# Altium schematic sheet STM32_Blue pill.SchDoc
size 431 x 279 mm; SheetNumber: 1; SheetTotal: 1
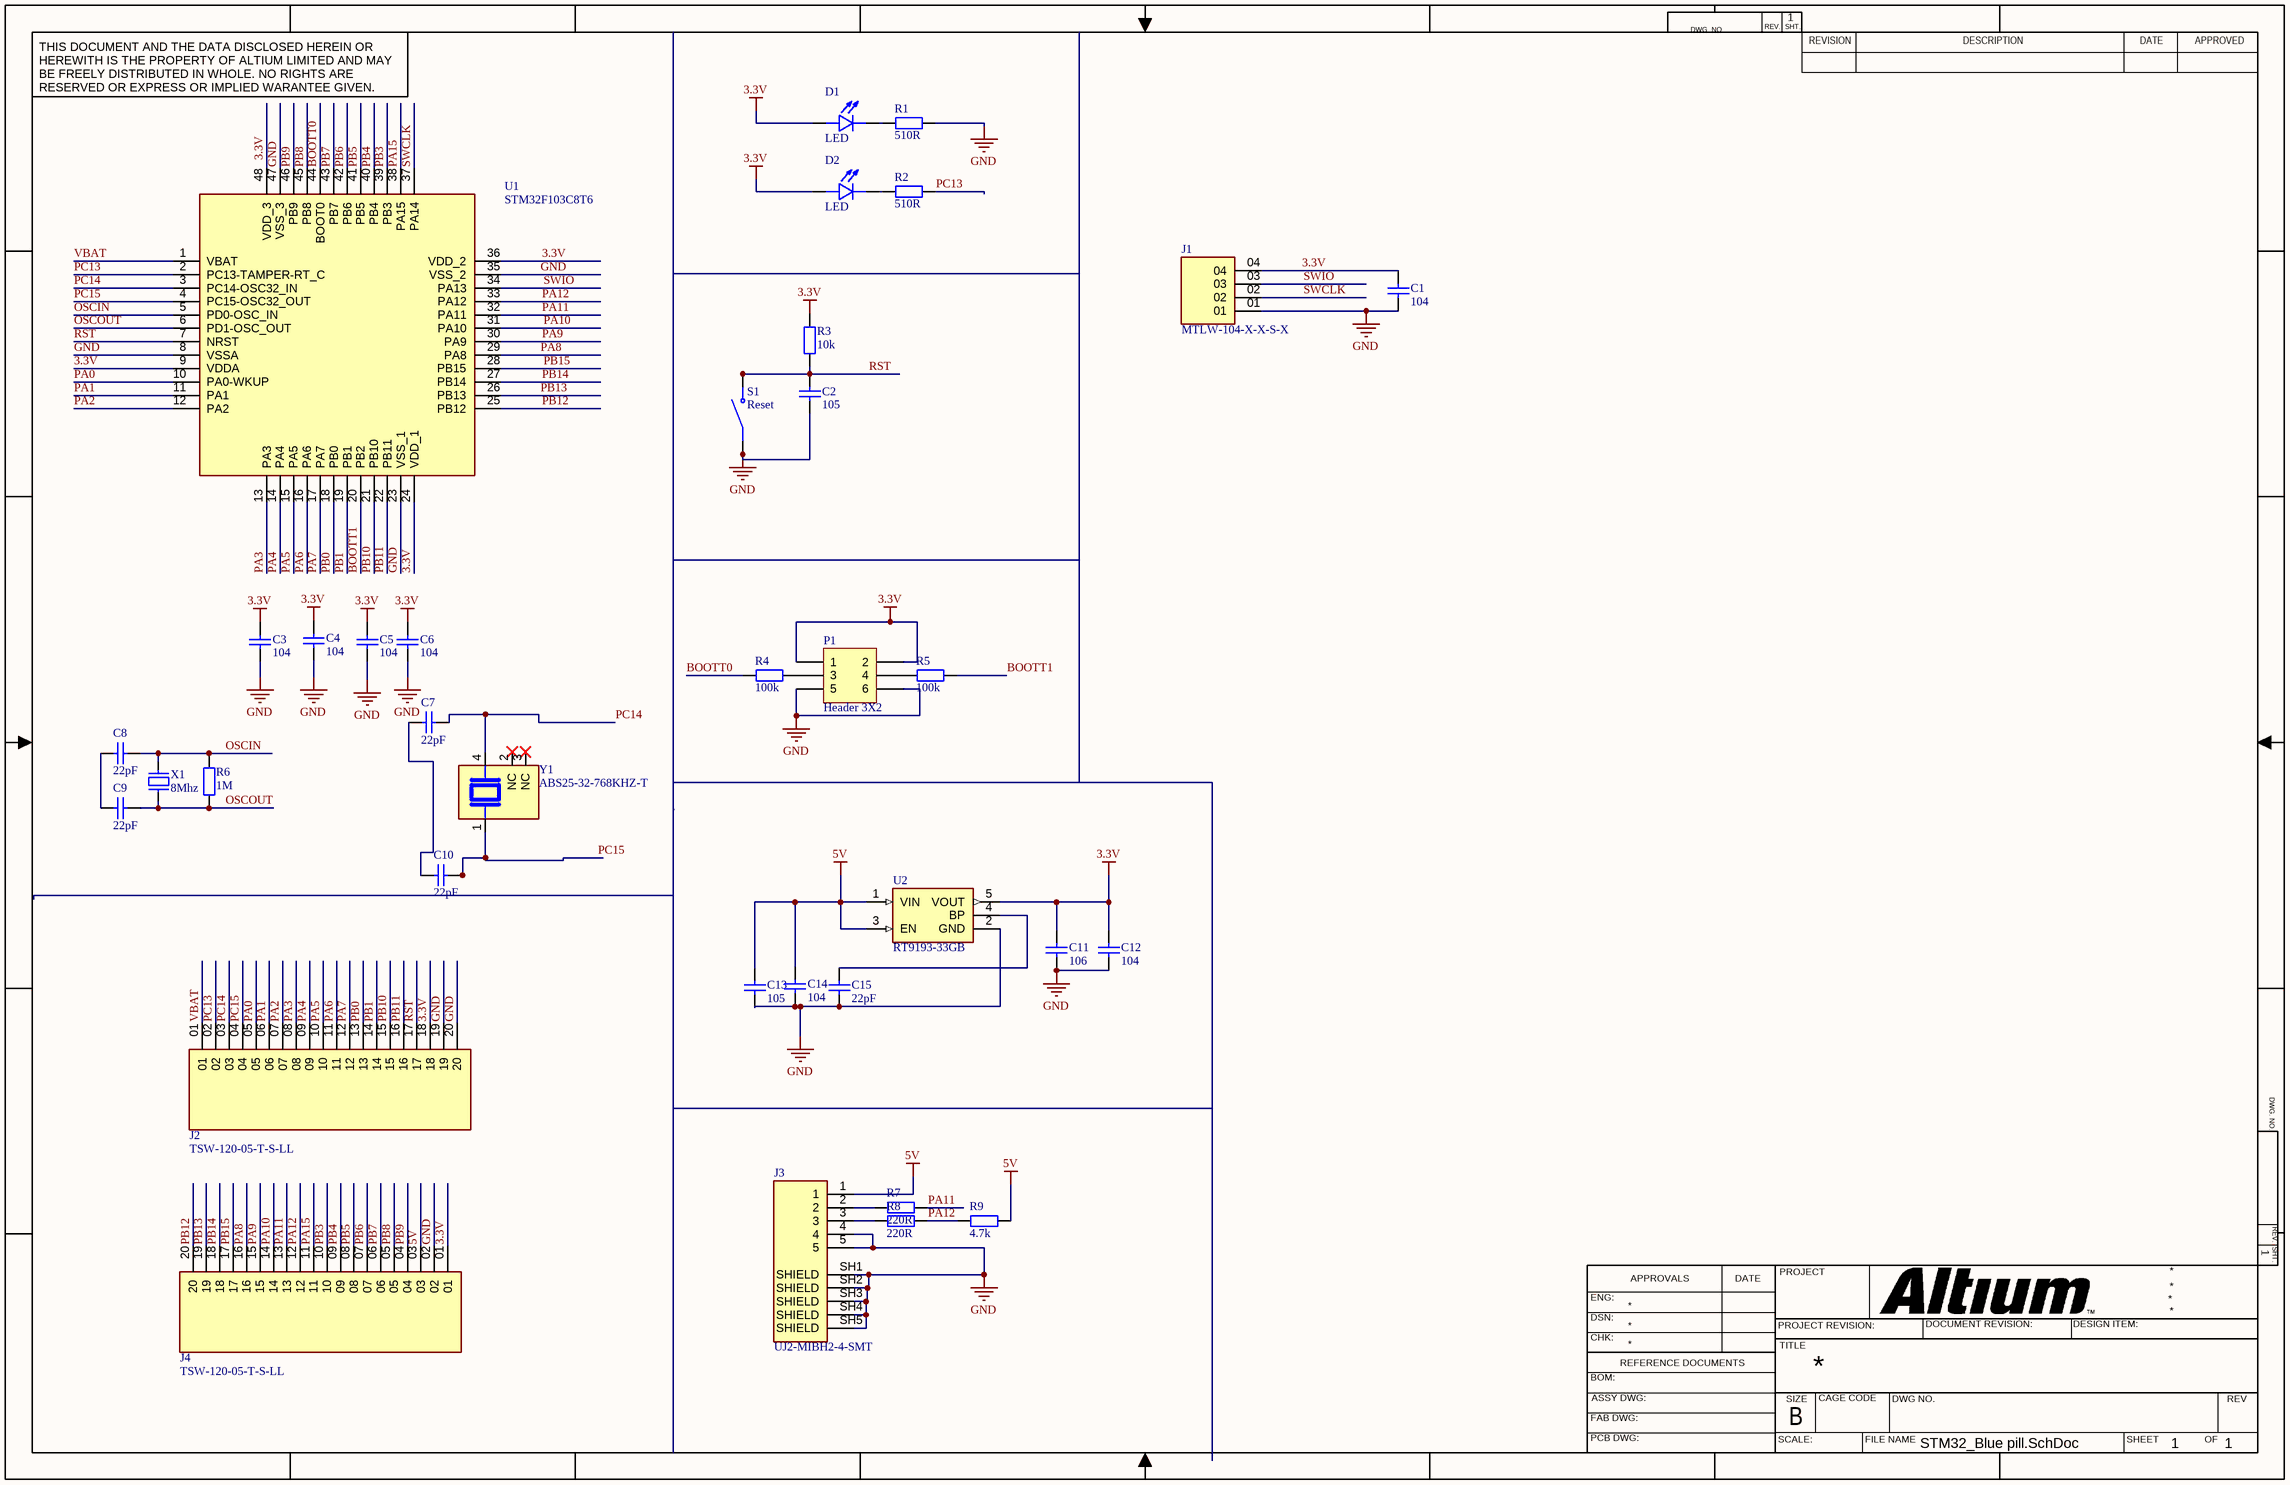
[diagram p0: STM32_Blue pill.SchDoc]

## Parts
C1  104  [tu 0603]
C2  105  [tu 0603]
C3  104  [tu 0603]
C4  104  [tu 0603]
C5  104  [tu 0603]
C6  104  [tu 0603]
C7  22pF  [tu 0603]
C8  22pF  [tu 0603]
C9  22pF  [tu 0603]
C10  22pF  [tu 0603]
C11  106  [tu 0805]
C12  104  [tu 0603]
C13  105  [tu 0805]
C14  104  [tu 0603]
C15  22pF  [tu 0603]
D1  LED  [LED_KP-1608SURCK]
D2  LED  [LED_KP-1608SURCK]
J1  MTLW-104-X-X-S-X  [SAMTEC_MTLW-104-X-X-S-X]
J2  TSW-120-05-T-S-LL  [SAMTEC_TSW-120-05-T-S-LL]
J3  UJ2-MIBH2-4-SMT  [CUI_UJ2-MIBH2-4-SMT]
J4  TSW-120-05-T-S-LL  [SAMTEC_TSW-120-05-T-S-LL]
P1  Header 3X2  [HDR2X3]
R1  510R  [tro smd 0603]
R2  510R  [tro smd 0603]
R3  10k  [tro smd 0603]
R4  100k  [tro smd 0603]
R5  100k  [tro smd 0603]
R6  1M  [tro smd 0805]
R7  220R  [tro smd 0603]
R8  220R  [tro smd 0603]
R9  4.7k  [tro smd 0603]
S1  Reset  [SW_8-1437565-1]
U1  STM32F103C8T6  [LQFP-48_19.6_393_58X11_SMD]
U2  RT9193-33GB  [SOT94P279X129-5N]
X1  8Mhz  [XT2]
Y1  ABS25-32-768KHZ-T  [XTAL_ABS25-32-768KHZ-T]

## Nets
3.3V: C1.1 C3.1 C4.1 C5.1 C6.1 C11.1 C12.1 D1.1(A) D2.1(A) J1.04 J2.18 J4.01 P1.1 P1.2 R3.2 U1.9(VDDA) U1.24(VDD_1) U1.36(VDD_2) U1.48(VDD_3) U2.5(VOUT)
5V: C13.1 C14.1 J3.1 J4.03 R9.2 U2.1(VIN) U2.3(EN)
GND: C1.2 C2.2 C3.2 C4.2 C5.2 C6.2 C11.2 C12.2 C13.2 C14.2 C15.2 J1.01 J2.19 J2.20 J3.4 J3.5 J3.SH1(SHIELD) J3.SH2(SHIELD) J3.SH3(SHIELD) J3.SH4(SHIELD) J3.SH5(SHIELD) J4.02 P1.5 P1.6 R1.2 S1.1(COM) S1.2(COM) U1.8(VSSA) U1.23(VSS_1) U1.35(VSS_2) U1.47(VSS_3) U2.2(GND)
BOOTT0: R4.1 U1.44(BOOT0)
BOOTT1: R5.2 U1.20(PB2)
OSCIN: C8.1 R6.2 U1.5(PD0-OSC_IN) X1.2
OSCOUT: C9.1 R6.1 U1.6(PD1-OSC_OUT) X1.1
PA0: J2.05 U1.10(PA0-WKUP)
PA1: J2.06 U1.11(PA1)
PA2: J2.07 U1.12(PA2)
PA3: J2.08 U1.13(PA3)
PA4: J2.09 U1.14(PA4)
PA5: J2.10 U1.15(PA5)
PA6: J2.11 U1.16(PA6)
PA7: J2.12 U1.17(PA7)
PA8: J4.16 U1.29(PA8)
PA9: J4.15 U1.30(PA9)
PA10: J4.14 U1.31(PA10)
PA11: J4.13 R7.2 U1.32(PA11)
PA12: J4.12 R8.2 R9.1 U1.33(PA12)
PA15: J4.11 U1.38(PA15)
PB0: J2.13 U1.18(PB0)
PB1: J2.14 U1.19(PB1)
PB3: J4.10 U1.39(PB3)
PB4: J4.09 U1.40(PB4)
PB5: J4.08 U1.41(PB5)
PB6: J4.07 U1.42(PB6)
PB7: J4.06 U1.43(PB7)
PB8: J4.05 U1.45(PB8)
PB9: J4.04 U1.46(PB9)
PB10: J2.15 U1.21(PB10)
PB11: J2.16 U1.22(PB11)
PB12: J4.20 U1.25(PB12)
PB13: J4.19 U1.26(PB13)
PB14: J4.18 U1.27(PB14)
PB15: J4.17 U1.28(PB15)
PC13: J2.02 R2.2 U1.2(PC13-TAMPER-RT_C)
PC14: C7.1 J2.03 U1.3(PC14-OSC32_IN) Y1.4
PC15: C10.1 J2.04 U1.4(PC15-OSC32_OUT) Y1.1
RST: C2.1 J2.17 R3.1 S1.3(NO) S1.4(NO) U1.7(NRST)
SWCLK: J1.02 U1.37(PA14)
SWIO: J1.03 U1.34(PA13)
VBAT: J2.01 U1.1(VBAT)
NetC7_2: C7.2 C10.2
NetC8_2: C8.2 C9.2
NetC15_1: C15.1 U2.4(BP)
NetD1_2: D1.2(C) R1.1
NetD2_2: D2.2(C) R2.1
NetJ3_2: J3.2 R7.1
NetJ3_3: J3.3 R8.1
NetP1_3: P1.3 R4.2
NetP1_4: P1.4 R5.1

Not connected (* = marked no-connect by the designer): Y1 2(NC)* 3(NC)*

## Notes on the sheet
- DWG. NO.
- REV.
- SHT.
- THIS DOCUMENT AND THE DATA DISCLOSED HEREIN OR HEREWITH IS THE PROPERTY OF ALTIUM LIMITED AND MAY BE FREELY DISTRIBUTED IN WHOLE. NO RIGHTS ARE RESERVED OR EXPRESS OR IMPLIED WARANTEE GIVEN.
- REVISION
- DESCRIPTION
- DATE
- APPROVED
- ENG:
- APPROVALS
- PROJECT
- DSN:
- CHK:
- REFERENCE DOCUMENTS
- PROJECT REVISION:
- TITLE
- DOCUMENT REVISION:
- DESIGN ITEM:
- BOM:
- FAB DWG:
- PCB DWG:
- ASSY DWG:
- SCALE:
- SIZE
- B
- CAGE CODE
- FILE NAME
- DWG NO.
- SHEET
- OF
- REV

## Library data of the parts
C1 C3-C6 C12 C14 = Tu 0603 104 50V 10%: Dán; Don_Vi: Con; So_Chan: 2; Ten_Linh_Kien: Tụ 0603 104-100nF 10% 50V; Ma_Hang: MH004568; Chung_Loai: Dán; Kieu_Chan: *
C2 = Tu 0603 105 50V 10%: Dán; Don_Vi: Con; So_Chan: 2; Ten_Linh_Kien: Tụ 0603 105-1uF 50V 10%; Ma_Hang: MH004569; Chung_Loai: Dán; Kieu_Chan: *
C7-C10 C15 = Tu 0603 22pF 50V 10%: Dán; Don_Vi: Con; So_Chan: 2; Ten_Linh_Kien: Tụ 0603 22pF 50V 10%; Ma_Hang: MH004570; Chung_Loai: Dán; Kieu_Chan: *
C11 = Tu 0805 106 16V 10%: Dán; Ten_Linh_Kien: Tụ 0805 106-10uF 10% 16V; So_Chan: 2; Don_Vi: Con; Ma_Hang: MH004553; Chung_Loai: Dán; Kieu_Chan: *
C13 = Tu 0805 105 50V 10%: Dán; Don_Vi: Con; So_Chan: 2; Ten_Linh_Kien: Tụ 0805 105-1uF 10% 50V; Ma_Hang: MH004552; Chung_Loai: Dán; Kieu_Chan: *
D1 D2 = KP-1608SURCK: LED; SMD; 0603; red; 50-150mcd; 1.6x0.8mm; 120Â°; 20mA;; MF: Kingbright; SnapEDA_Link: https://www.snapeda.com/parts/KP-1608SURCK/Kingbright/view-part/?ref=snap; Package: 0603 Kingbright; Value: *; MP: KP-1608SURCK; Check_prices: https://www.snapeda.com/parts/KP-1608SURCK/Kingbright/view-part/?ref=eda
J1 = MTLW-104-X-X-S-X: MF: {'manufacturer': u'Samtec Inc.'}; Package: None; Price: None; Value: *; MP: MTLW-104-X-X-S-X; Availability: Unavailable
J3 = UJ2-MIBH2-4-SMT: Micro B, USB 2.0, 1.8 A, Right Angle, Surface Mount (SMT), USB Receptacle; MF: CUI Devices; Value: *; CUI_purchase_URL: https://www.cuidevices.com/product/interconnect/connectors/usb-connectors/uj2-mibh2-4-smt?utm_source=snapeda.com&utm_medium=referral&utm_campaign=snapedaBOM; Check_prices: https://www.snapeda.com/parts/UJ2-MIBH2-4-SMT/CUI+Devices/view-part/?ref=eda; SnapEDA_Link: https://www.snapeda.com/parts/UJ2-MIBH2-4-SMT/CUI+Devices/view-part/?ref=snap; Availability: In Stock; MP: UJ2-MIBH2-4-SMT; Purchase-URL: https://pricing.snapeda.com/search/part/UJ2-MIBH2-4-SMT/?ref=eda; Package: None; Price: None
P1 = Header 3X2: Header, 3-Pin, Dual row; LatestRevisionDate: 17-Jul-2002; LatestRevisionNote: Re-released for DXP Platform.; Publisher: Altium Limited
R1 R2 = Tro 0603 5% 510R: Dán; Don_Vi: Con; So_Chan: 2; Ten_Linh_Kien: Trở 0603 5% 510R; Ma_Hang: MH007667; Chung_Loai: Dán; Kieu_Chan: *
R3 = Tro 0603 1% 10k: Dán; Don_Vi: Con; So_Chan: 2; Ten_Linh_Kien: Trở 0603 1% 10k; Ma_Hang: MH006333; Chung_Loai: Dán; Kieu_Chan: *
R4 R5 = Tro 0603 5% 100k: Dán; So_Chan: 2; Ten_Linh_Kien: Trở 0603 5% 100k; Ma_Hang: MH006314; Don_Vi: Con; Chung_Loai: Dán; Kieu_Chan: *
R6 = Tro 0805 1% 1M: Dán; Don_Vi: Con; So_Chan: 2; Ten_Linh_Kien: Trở 0805 1% 1M; Ma_Hang: MH005469; Chung_Loai: Dán; Kieu_Chan: *
R7 R8 = Tro 0603 5% 220R: Dán; Don_Vi: Con; So_Chan: 2; Ten_Linh_Kien: Trở 0603 5% 220R; Ma_Hang: MH006322; Chung_Loai: Dán; Kieu_Chan: *
R9 = Tro 0603 5% 4.7k: Dán; Don_Vi: Con; So_Chan: 2; Ten_Linh_Kien: Trở 0603 5% 4.7k; Ma_Hang: MH006327; Chung_Loai: Dán; Kieu_Chan: *
S1 = 8-1437565-1: Package: None; MP: 8-1437565-1; Price: None; Availability: Unavailable; Value: *
U1 = IC_STM32F103C8T6: ARM® Cortex®-M3 STM32F1 Microcontroller IC 32-Bit 72MHz 64KB (64K x 8) FLASH 48-LQFP (7x7); Manufacturer: STMicroelectronics; Alternate Part Number-1: NA; Manufacturer Part Number: STM32F103C8T6; Case/Package: LQFP48; Supplier-1: LCSC; Supplier Part Number-1: STM32F103C8T6
U2 = RT9193-33GB: Linear Voltage Regulator IC Positive Fixed 1 Output 300mA TSOT-23-5; MF: Richtek USA; SnapEDA_Link: https://www.snapeda.com/parts/RT9193-33GB/Richtek+USA+Inc./view-part/?ref=snap; Package: SOT-23-5 Richtek; MP: RT9193-33GB; Check_prices: https://www.snapeda.com/parts/RT9193-33GB/Richtek+USA+Inc./view-part/?ref=eda; Purchase-URL: https://pricing.snapeda.com/search/part/RT9193-33GB/?ref=eda; Digi-Key_Part_Number: 1028-1014-2-ND; Value: *
X1 = XT2: Crystal For all Crystal 2pin.; Value: 4Mhz
Y1 = ABS25-32-768KHZ-T: Crystal 0.032768MHz Â±20ppm (Tol) 12.5pF FUND 50000Ohm 4-Pin SMD T/R; MF: Abracon; SnapEDA_Link: https://www.snapeda.com/parts/ABS25-32-768KHZ-T/Abracon/view-part/?ref=snap; Package: Package; Value: *; MP: ABS25-32-768KHZ-T; Check_prices: https://www.snapeda.com/parts/ABS25-32-768KHZ-T/Abracon/view-part/?ref=eda
J2 J4 = TSW-120-05-T-S-LL: Package: None; Price: None; Value: *; MP: TSW-120-05-T-S-LL; Availability: Unavailable